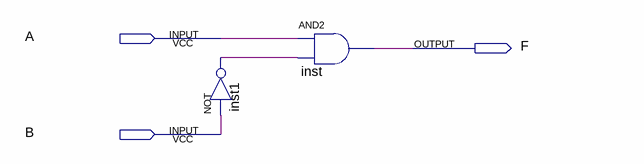
[diagram p0: schematic sheet]
// Quartus schematic maior.bdf as structural Verilog: 2 symbols, 3 pins
module maior (
  input  A,
  input  B,
  output F
);

  wire inst1_out;

  not inst1 (inst1_out, B);
  and inst (F, A, inst1_out);
endmodule
